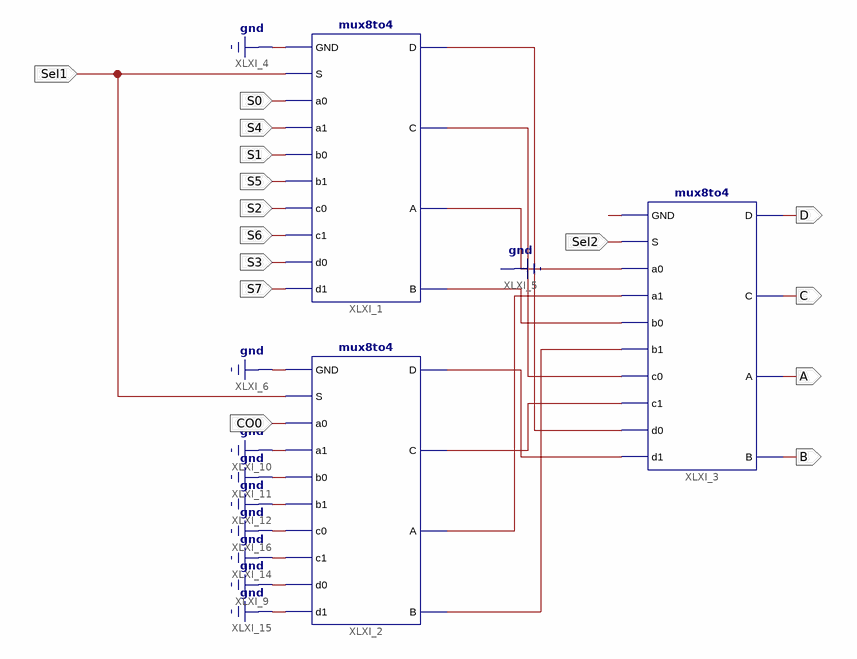
[diagram p0: schematic sheet 1]
// Xilinx ISE schematic MUX4_1.sch (spartan6) as structural Verilog: 3 symbols, 15 ports
module MUX4_1 (
  input  S7,
  input  Sel1,
  input  Sel2,
  input  S0,
  input  S4,
  input  S1,
  input  S5,
  input  S2,
  input  S6,
  input  S3,
  input  CO0,
  output D,
  output C,
  output A,
  output B
);

  wire XLXN_7, XLXN_8, XLXN_9, XLXN_10, XLXN_11, XLXN_12, XLXN_13, XLXN_14;

  mux8to4 XLXI_1 (
    .GND(1'b0), .S(Sel1), .a0(S0), .a1(S4), .b0(S1), .b1(S5), .c0(S2), .c1(S6), .d0(S3), .d1(S7), .D(XLXN_7),
    .C(XLXN_8), .A(XLXN_9), .B(XLXN_10));
  mux8to4 XLXI_3 (
    .GND(1'b0), .S(Sel2), .a0(XLXN_9), .a1(XLXN_13), .b0(XLXN_10), .b1(XLXN_14), .c0(XLXN_8), .c1(XLXN_12),
    .d0(XLXN_7), .d1(XLXN_11), .D(D), .C(C), .A(A), .B(B));
  mux8to4 XLXI_2 (
    .GND(1'b0), .S(Sel1), .a0(CO0), .a1(1'b0), .b0(1'b0), .b1(1'b0), .c0(1'b0), .c1(1'b0), .d0(1'b0),
    .d1(1'b0), .D(XLXN_11), .C(XLXN_12), .A(XLXN_13), .B(XLXN_14));
endmodule
